# Altium schematic sheet 1_Shutdown_Circuit.SchDoc
size A4; SheetNumber: 1; SheetTotal: 8
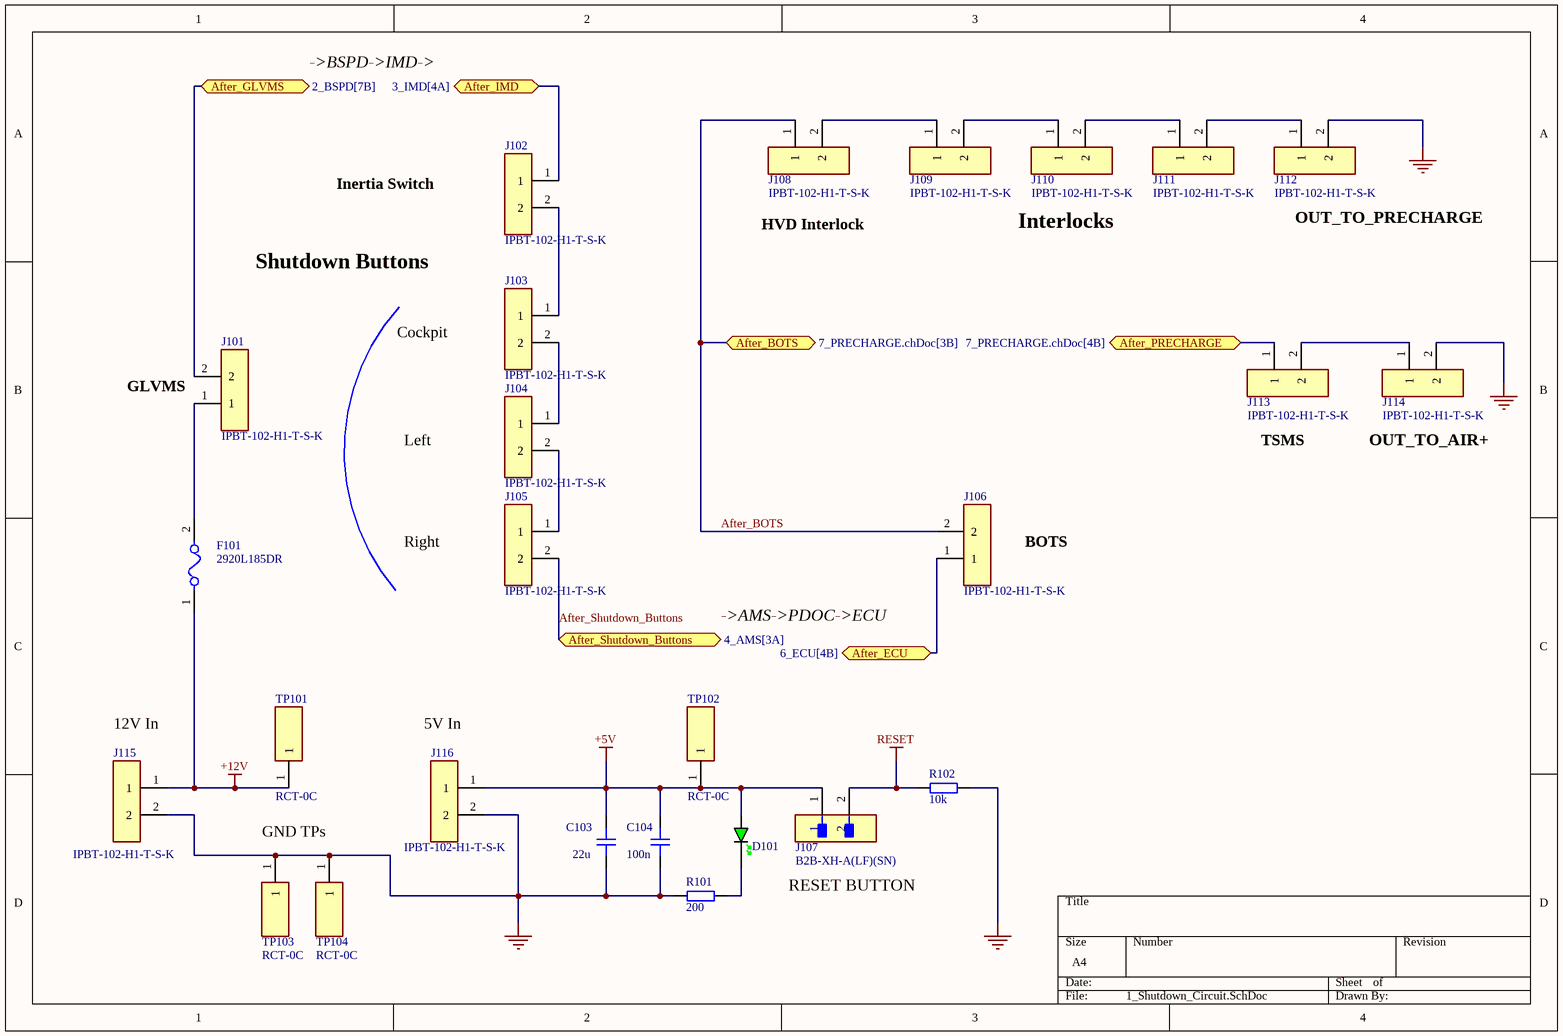
[diagram p0: 1_Shutdown_Circuit.SchDoc]

## Parts
C103  22u  [CAP_0805]
C104  100n  [CAP_0805]
D101  GREEN  [LED_0805_GREEN]  (value not drawn)
F101  2920L185DR  [FP-2920L-MFG]
J101  IPBT-102-H1-T-S-K  [SAMTEC_IPBT-102-H1-T-S-K]
J102  IPBT-102-H1-T-S-K  [SAMTEC_IPBT-102-H1-T-S-K]
J103  IPBT-102-H1-T-S-K  [SAMTEC_IPBT-102-H1-T-S-K]
J104  IPBT-102-H1-T-S-K  [SAMTEC_IPBT-102-H1-T-S-K]
J105  IPBT-102-H1-T-S-K  [SAMTEC_IPBT-102-H1-T-S-K]
J106  IPBT-102-H1-T-S-K  [SAMTEC_IPBT-102-H1-T-S-K]
J107  B2B-XH-A(LF)(SN)  [FP-B2B-XH-A_LF_SN-MFG]
J108  IPBT-102-H1-T-S-K  [SAMTEC_IPBT-102-H1-T-S-K]
J109  IPBT-102-H1-T-S-K  [SAMTEC_IPBT-102-H1-T-S-K]
J110  IPBT-102-H1-T-S-K  [SAMTEC_IPBT-102-H1-T-S-K]
J111  IPBT-102-H1-T-S-K  [SAMTEC_IPBT-102-H1-T-S-K]
J112  IPBT-102-H1-T-S-K  [SAMTEC_IPBT-102-H1-T-S-K]
J113  IPBT-102-H1-T-S-K  [SAMTEC_IPBT-102-H1-T-S-K]
J114  IPBT-102-H1-T-S-K  [SAMTEC_IPBT-102-H1-T-S-K]
J115  IPBT-102-H1-T-S-K  [SAMTEC_IPBT-102-H1-T-S-K]
J116  IPBT-102-H1-T-S-K  [SAMTEC_IPBT-102-H1-T-S-K]
R101  200  [RES_0805]
R102  10k  [RES_0805]
TP101  RCT-0C  [RCT-0C]
TP102  RCT-0C  [RCT-0C]
TP103  RCT-0C  [RCT-0C]
TP104  RCT-0C  [RCT-0C]

## Ports
After_BOTS (bidir, see 7_PRECHARGE.chDoc[3B]), After_ECU (bidir, see 6_ECU[4B]), After_GLVMS (bidir, see 2_BSPD[7B]), After_IMD (bidir, see 3_IMD[4A]), After_PRECHARGE (bidir, see 7_PRECHARGE.chDoc[4B]), After_Shutdown_Buttons (bidir, see 4_AMS[3A])

## Nets
+5V: C103.2 C104.2 D101.A J107.1 J116.1 TP102.1
+12V: F101.1 J115.1 TP101.1
GND: C103.1 C104.1 J112.2 J114.2 J115.2 J116.2 R101.1 R102.1 TP103.1 TP104.1
RESET: J107.2 R102.2
After_BOTS: J106.2 J108.1 ; port After_BOTS
After_ECU: J106.1 ; port After_ECU
After_GLVMS: J101.2 ; port After_GLVMS
After_IMD: J102.1 ; port After_IMD
After_PRECHARGE: J113.1 ; port After_PRECHARGE
After_Shutdown_Buttons: J105.2 ; port After_Shutdown_Buttons
NetD101_K: D101.K R101.2
NetF101_2: F101.2 J101.1
NetJ102_2: J102.2 J103.1
NetJ103_2: J103.2 J104.1
NetJ104_2: J104.2 J105.1
NetJ108_2: J108.2 J109.1
NetJ109_2: J109.2 J110.1
NetJ110_2: J110.2 J111.1
NetJ111_2: J111.2 J112.1
NetJ113_2: J113.2 J114.1

## Notes on the sheet
- ->BSPD->IMD->
- Inertia Switch
- HVD Interlock
- Interlocks
- OUT_TO_PRECHARGE
- Shutdown Buttons
- Cockpit
- GLVMS
- Left
- TSMS
- OUT_TO_AIR+
- Right
- BOTS
- ->AMS->PDOC->ECU
- 12V In
- 5V In
- GND TPs
- RESET BUTTON

## Library data of the parts
C103 C104 = CAP_0805: Capacitor SMD 0805; Manufacturer: *; Manufacturer Part Number: *; Distributor Link: *; LCSC: *; Rating: *; Dielectric: *
D101 = LED_0805_GREEN: LED 0805 GREEN SMD; Manufacturer: *; Manufacturer Part Number: *; Distributor Link: *; LCSC: *
F101 = CMP-08606-000019-1: PTC RESET FUSE 33V 1.85A 2920; Manufacturer: Littelfuse; Current Rating: 40A; Value: 0.05-0.15Ω; Trip Time: 2.5s; Trip Current: 3.7A; Device Class L2: PTC Resettable Fuses; ComponentLink2Description: Datasheet; Automotive: No; Category: Fuse; RoHS: TRUE; ComponentLink2URL: https://www.littelfuse.com/~/media/electronics/datasheets/resettable_ptcs/littelfuse_ptc_2920l_datasheet.pdf.pdf; Temperature Range High: +85°C; Resistance: 0.05-0.15Ω; Digikey Description: PTC RESET FUSE 33V 1.85A 2920; Height: 1.25mm; Lead Free: Yes; Octopart: https://octopart.com/2920l185dr-littelfuse-673785; Mouser Description: Resettable Fuses - PPTC 1.85A 33V 2920; Hold Current: 1.85A; Manufacturer Part Number: 2920L185DR; Temperature: -40°C to +85°C; Device Class L1: Circuit Protection; Voltage Rating: 33V; Device Class L3: unset; Temperature Range Low: -40°C; Package: 2920L
J101-J106 J108-J116 = CMP-034-000000-7: .165" Power Mate Isolated Power Terminal Header; MF: Samtec; Component Type: Standard; Value: *; Price: None; MP: IPBT-102-H1-T-S-K; Design Item ID: IPBT-102-H1-T-S-K; Pin Count: 2; Package: None; Availability: Unavailable; Source: IPBT-102-H1-T-S-K.SchLib
J107 = CMP-2000-05888-3: CONN HEADER VERT 2POS 2.5MM; Current Rating: 3A; Voltage Rating: 250V; Number of Contacts: 2; Contact Resistance: 20mR; Wire/Cable Gauge: 22AWG; Insulation Resistance: 1GR; Connector Type: Male Pin; Packaging: Bulk; Contact Material: Brass; Lead Free: Lead Free; Orientation: Straight; Contact Plating: Tin; Max Current Rating: 3A; Termination: Solder; Fastening Type: Detent; Depth: 5.75mm; Housing Material: Polyamide; REACH SVHC: No SVHC; Series: XH; Voltage Rating (AC): 250V; Number of Positions: 2; Color: Natural; Contact Type: Male Pin; Max Voltage Rating (DC): 250V; Pitch: 2.5mm; Lead Pitch: 2.5mm; Mount: Through Hole; Max Operating Temperature: 85°C; Length: 7.4mm; Max Voltage Rating (AC): 250V; Min Operating Temperature: -25°C; Number of Rows: 1; Housing Color: White
R101 R102 = RES_0805: Resistor SMD 0805; Manufacturer: *; Manufacturer Part Number: *; Distributor Link: *; LCSC: *
TP101-TP104 = RCT-0C: Test Point; Manufacturer_Name: TE Connectivity; Datasheet Link: https://www.te.com/commerce/DocumentDelivery/DDEController?Action=srchrtrv&DocNm=1773266&DocType=Data%20Sheet&DocLang=English&PartCntxt=1625854-2&DocFormat=pdf; Manufacturer_Part_Number: RCT-0C; Mouser Part Number: 279-RCT-0C; Mouser Price/Stock: https://www.mouser.co.uk/ProductDetail/TE-Connectivity-Holsworthy/RCT-0C?qs=ip69W3eHERWzZOsRKmFYAw%3D%3D; Arrow Part Number: RCT-0C; Arrow Price/Stock: https://www.arrow.com/en/products/rct-0c/te-connectivity?region=nac